# Altium schematic sheet ESP32_CAM.SchDoc
size B; ApprovedBy: Kosnstantine; Engineer: Ehsan Shaghaei; SheetNumber: 2; SheetTotal: 7
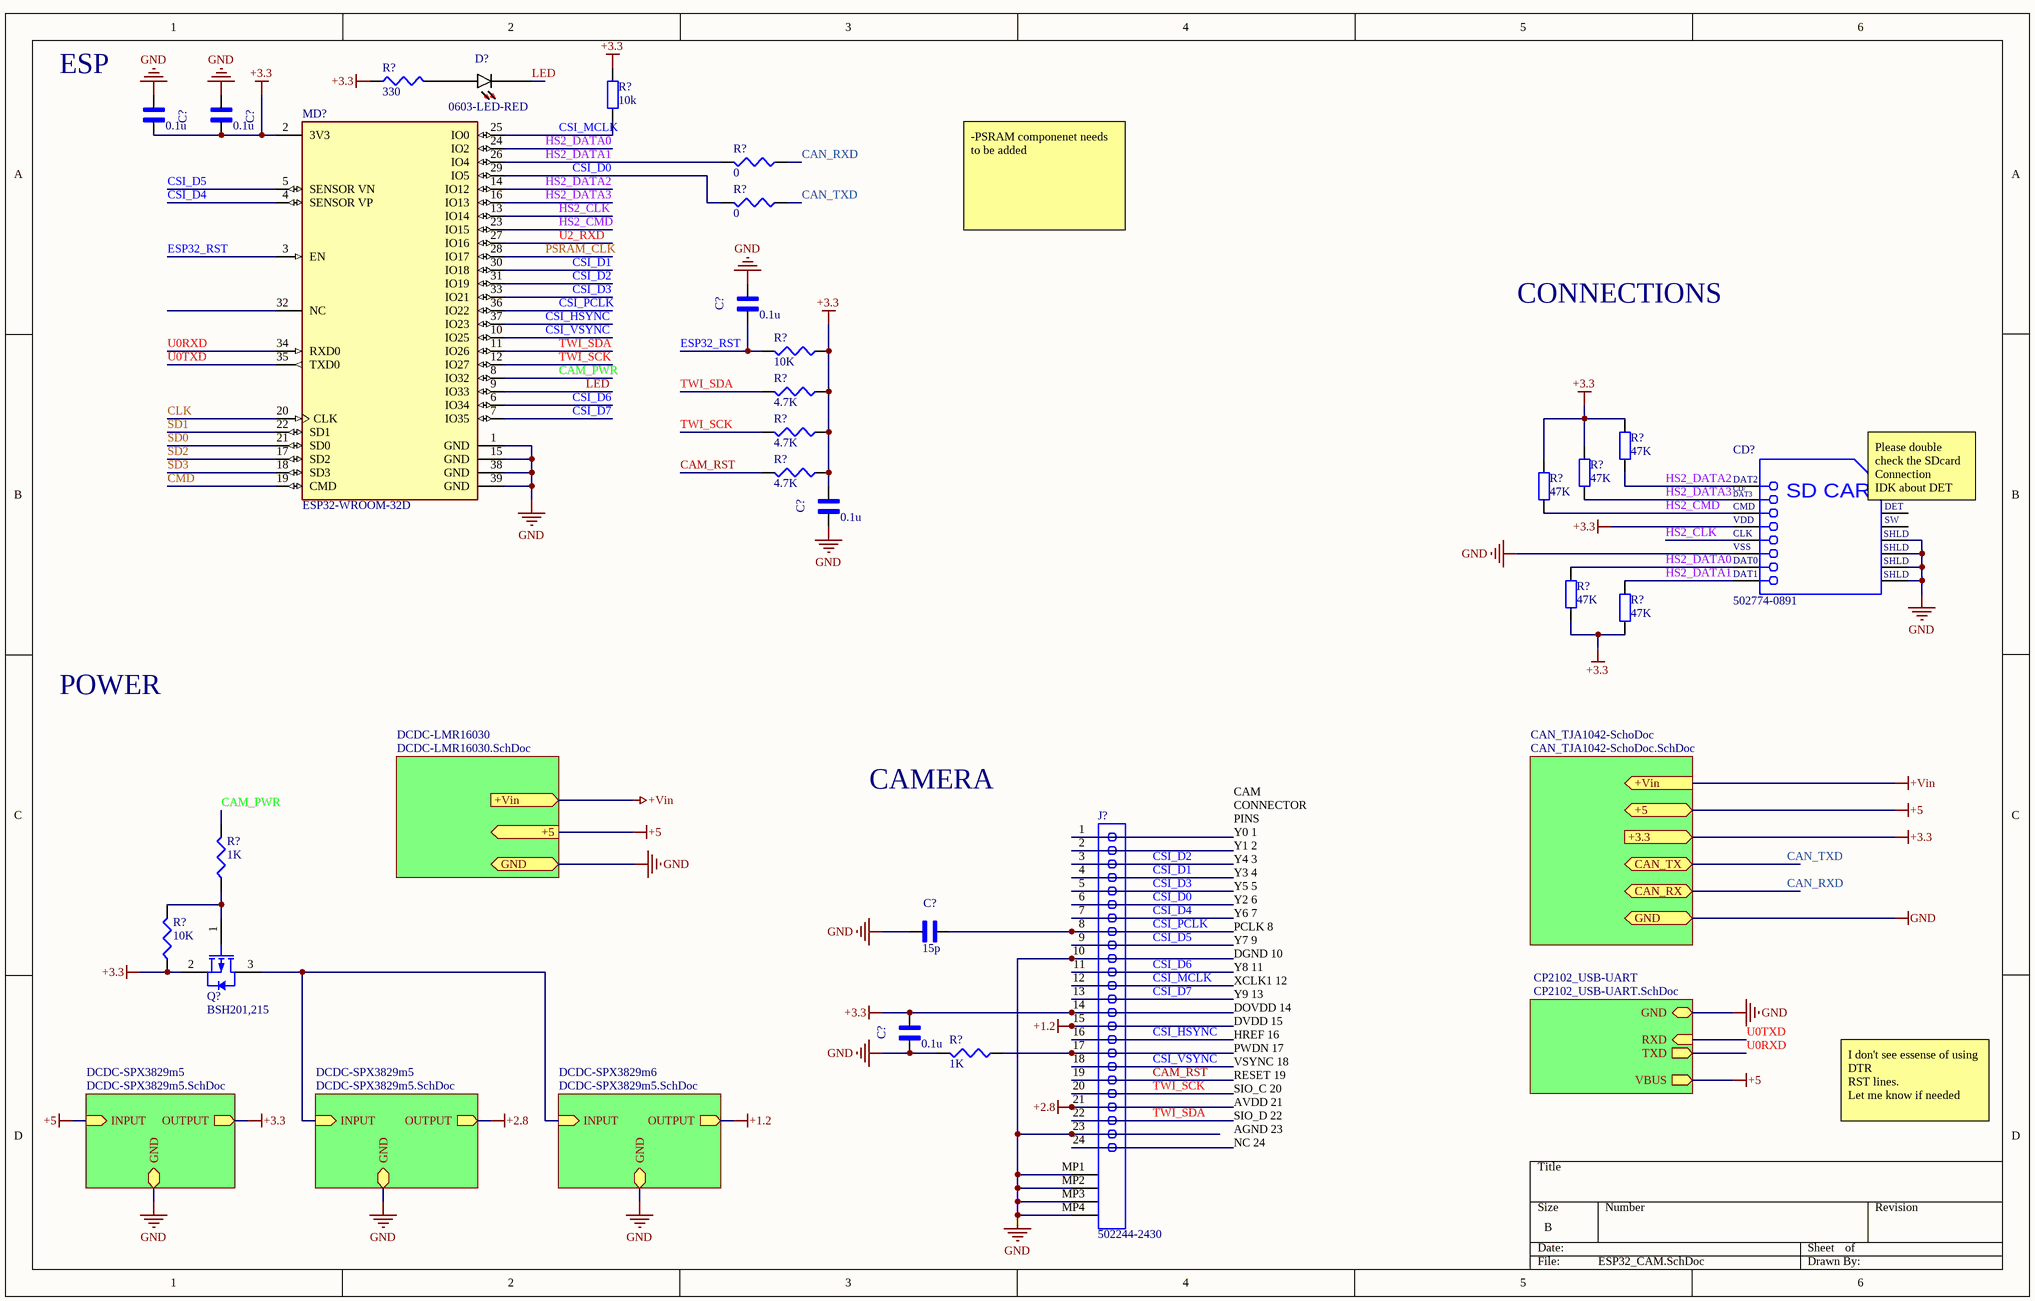
[diagram p0: ESP32_CAM.SchDoc]

## Parts
(Parts that share a designator on the sheet are numbered #1, #2 ... from top to bottom, then left to right.)
C?#1  value 0.1u  [*CAPC1608X90]  (hidden comment: GX035C104MAT2-500)
C?#2  value 0.1u  [*CAPC1608X90]  (hidden comment: GX035C104MAT2-500)
C?#3  value 0.1u  [*CAPC1608X90]  (hidden comment: GX035C104MAT2-500)
C?#4  value 0.1u  [*CAPC1608X90]  (hidden comment: GX035C104MAT2-500)
C?#5  value 15p  [*CAPC1608X90]  (hidden comment: GX035C104MAT2-500)
C?#6  value 0.1u  [*CAPC1608X90]  (hidden comment: GX035C104MAT2-500)
CD?  502774-0891  [MOLX-502774-0891_V]
D?  0603-LED-RED  [*LEDM1608X80_LTE-C1906R-14(Primary)]
J?  502244-2430  [MOLX-502244-2430]
MD?  ESP32-WROOM-32D  [FP-ESP32-WROOM-32D-MFG]
Q?  BSH201,215  [NXP-SOT23_M]
R?#1  value 330  [J1-0603]  (hidden comment: RC0603FR-07330RL)
R?#2  value 10k  [0603]  (hidden comment: Res2)
R?#3  value 0  [J1-0603]  (hidden comment: Res3)
R?#4  value 0  [J1-0603]  (hidden comment: Res3)
R?#5  value 10K  [J1-0603]  (hidden comment: Res3)
R?#6  value 4.7K  [J1-0603]  (hidden comment: Res3)
R?#7  value 4.7K  [J1-0603]  (hidden comment: Res3)
R?#8  value 47K  [0603]  (hidden comment: Res2)
R?#9  value 4.7K  [J1-0603]  (hidden comment: Res3)
R?#10  value 47K  [0603]  (hidden comment: Res2)
R?#11  value 47K  [0603]  (hidden comment: Res2)
R?#12  value 47K  [0603]  (hidden comment: Res2)
R?#13  value 47K  [0603]  (hidden comment: Res2)
R?#14  value 1K  [J1-0603]  (hidden comment: Res3)
R?#15  value 10K  [J1-0603]  (hidden comment: Res3)
R?#16  value 1K  [J1-0603]  (hidden comment: Res3)

## Sub-sheets
CAN_TJA1042-SchoDoc = CAN_TJA1042-SchoDoc.SchDoc: no entries
CP2102_USB-UART = CP2102_USB-UART.SchDoc: GND (bidir), VBUS (out), TXD (out), RXD (in)
DCDC-LMR16030 = DCDC-LMR16030.SchDoc: no entries
DCDC-SPX3829m5 = DCDC-SPX3829m5.SchDoc: GND (bidir), INPUT (in), OUTPUT (out)
DCDC-SPX3829m5 = DCDC-SPX3829m5.SchDoc: GND (bidir), INPUT (in), OUTPUT (out)
DCDC-SPX3829m6 = DCDC-SPX3829m5.SchDoc: GND (bidir), INPUT (in), OUTPUT (out)

## Ports
+3.3 (in), +5 (bidir), +5 (out), +Vin (in), +Vin (out), CAN_RX (bidir), CAN_TX (bidir), GND (bidir)

## Nets
+1.2: J?.15 ; sheet DCDC-SPX3829m6/OUTPUT
+2.8: J?.21 ; sheet DCDC-SPX3829m5/OUTPUT
+3.3: C?#1.1 C?#2.1 C?#4.1 C?#6.1 CD?.4(VDD) J?.14 MD?.2(3V3) Q?.2(S) R?#1.1 R?#2.2 R?#5.1 R?#6.1 R?#7.1 R?#8.2 R?#9.1 R?#10.2 R?#11.2 R?#12.2 R?#13.2 R?#15.1 ; port +3.3, sheet DCDC-SPX3829m5/OUTPUT
+5: port +5, sheet DCDC-SPX3829m5/INPUT, sheet CP2102_USB-UART/VBUS
+Vin: port +Vin
GND: C?#1.2 C?#2.2 C?#3.1 C?#4.2 C?#5.2 C?#6.2 CD?.6(VSS) CD?.11(SHLD) CD?.12(SHLD) CD?.13(SHLD) CD?.14(SHLD) J?.10 J?.23 J?.MP1 J?.MP2 J?.MP3 J?.MP4 MD?.1(GND) MD?.15(GND) MD?.38(GND) MD?.39(GND) R?#16.2 ; port GND, sheet DCDC-SPX3829m5/GND, sheet DCDC-SPX3829m5/GND, sheet DCDC-SPX3829m6/GND, sheet CP2102_USB-UART/GND
CAM_PWR: MD?.8(IO32) R?#14.2
CAM_RST: J?.19 R?#9.2
CAN_RXD: R?#3.1 ; port CAN_RX
CAN_TXD: R?#4.1 ; port CAN_TX
CLK: MD?.20(CLK)
CMD: MD?.19(CMD)
CSI_D0: J?.6 MD?.29(IO5) R?#4.2
CSI_D1: J?.4 MD?.30(IO18)
CSI_D2: J?.3 MD?.31(IO19)
CSI_D3: J?.5 MD?.33(IO21)
CSI_D4: J?.7 MD?.4(SENSOR_VP)
CSI_D5: J?.9 MD?.5(SENSOR_VN)
CSI_D6: J?.11 MD?.6(IO34)
CSI_D7: J?.13 MD?.7(IO35)
CSI_HSYNC: J?.16 MD?.37(IO23)
CSI_MCLK: J?.12 MD?.25(IO0) R?#2.1
CSI_PCLK: C?#5.1 J?.8 MD?.36(IO22)
CSI_VSYNC: J?.18 MD?.10(IO25)
ESP32_RST: C?#3.2 MD?.3(EN) R?#5.2
HS2_CLK: CD?.5(CLK) MD?.13(IO14)
HS2_CMD: CD?.3(CMD) MD?.23(IO15) R?#11.1
HS2_DATA0: CD?.7(DAT0) MD?.24(IO2) R?#12.1
HS2_DATA1: CD?.8(DAT1) MD?.26(IO4) R?#3.2 R?#13.1
HS2_DATA2: CD?.1(DAT2) MD?.14(IO12) R?#8.1
HS2_DATA3: CD?.2(CD/DAT3) MD?.16(IO13) R?#10.1
LED: D?.C MD?.9(IO33)
PSRAM_CLK: MD?.28(IO17)
SD0: MD?.21(SD0)
SD1: MD?.22(SD1)
SD2: MD?.17(SD2)
SD3: MD?.18(SD3)
TWI_SCK: J?.20 MD?.12(IO27) R?#7.2
TWI_SDA: J?.22 MD?.11(IO26) R?#6.2
U0RXD: MD?.34(RXD0) ; sheet CP2102_USB-UART/TXD
U0TXD: MD?.35(TXD0) ; sheet CP2102_USB-UART/RXD
U2_RXD: MD?.27(IO16)
NetD?_A: D?.A R?#1.2
NetJ?_17: J?.17 R?#16.1
NetQ?_1: Q?.1(G) R?#14.1 R?#15.2
NetQ?_3: Q?.3(D) ; sheet DCDC-SPX3829m5/INPUT, sheet DCDC-SPX3829m6/INPUT

Not connected (* = marked no-connect by the designer): CD? 9(DETECT) 10(SWITCH); J? 1 2 24; MD? 32(NC)

## Notes on the sheet
- ESP
- -PSRAM componenet needs to be added
- CONNECTIONS
- (near CD?) Please double check the SDcard Connection
  IDK about DET and SW
- POWER
- CAMERA
- I don't see essense of using
  DTR
  RST lines.
  Let me know if needed
- CAM CONNECTOR PINS
  Y0 1
  Y1 2
  Y4 3
  Y3 4
  Y5 5
  Y2 6
  Y6 7
  PCLK 8
  Y7 9
  DGND 10
  Y8 11
  XCLK1 12
  Y9 13
  DOVDD 14
  DVDD 15
  HREF 16
  PWDN 17
  VSYNC 18
  RESET 19
  SIO_C 20
  AVDD 21
  SIO_D 22
  AGND 23
  NC 24
- (in symbol CMP-2000-05248-1) CD/; DAT3; SD CARD; DET; SW

## Library data of the parts
C?#1-C?#6 = GX035C104MAT2-500: Cap Thin Film 0.1uf 50v 0603; MF: AVX; MP: GX035C104MAT2-500 or CL10B104JB8NNNC; Pacage Metric: 1608; Type: SMD; Package: 0603 AVX; SnapEDA_Link: https://www.snapeda.com/parts/GX035C104MAT2-500/AVX/view-part/?ref=snap
CD? = CMP-2000-05248-1: Micro SD Memory Card Connector, 0.5 A, 10 V (DC), -25 to 85 degC, 8-Pin SMT, RoHS, Tape and Reel; Manufacturer: Molex; 3D Model: 502774-0891.stp; Online Catalog: microSD™Series; Number of Positions: 10(8+2); Card Type: SecureDigital-microSD™; Insertion, Removal Method: PushIn,PushOut; Other Names: WM24066DKR; Connector Type: ConnectorandEjector; Value: 1n; Features: Switch; Family: MemoryConnectors-PCCardSockets; Manufacturer URL: http://www.molex.com/; Mounting Type: SurfaceMount,RightAngle; Contact Finish Thickness: 20µin(0.51µm); Standard Package: 1; Series: 502774; Ejector Side: -; Datasheet Version: Rev. D, 04/2004; Category: Connectors,Interconnects; Contact Finish: Gold; Datasheet URL: https://datasheet.ciiva.com/1104/1499551-1104671.pdf; RoHS Information: 502774-0891CertofCompliance; Mounting Feature: Reverse-Bottom; Packaging: Digi-Reel; Height Above Board: 0.071"(1.80mm); Catalog Drawings: 502774-0891
D? = 0603-LED-RED: Red 620nm LED Indication - Discrete 2.2V 0603 (1608 Metric); MP: LTST-C194KRKT or SML-D12U1WT86; Type: SMD; Package: 0603 Lite-On; SnapEDA_Link: https://www.snapeda.com/parts/LTE-C1906R-14/Lite-On%20Inc./view-part/?ref=snap; Value: *
J? = CMP-1243-00005-1: 0.5 mm Pitch Easy-On(TM) Type FFC Connector, for LVDS, 2.33 mm Mated Height, Right Angle, ZIF, SMT, Bottom Contact, 24 Circuits, -25 to 85 degC, ELV and RoHS Compliant, Tape and Reel; Manufacturer: Molex; Circuits (Loaded): 24; Material - Plating Mating: Gold; Entry Angle: 90degrees Angle; Pitch - Mating Interface: 0.50mm; PCB Locator: No; Material - Metal: Phosphor Bronze; PCB Retention: Yes; Current (Max per Contact): 0.4A; Mated Height: 2.33mm; Durability (mating cycles max): 20; Voltage (Max): 50V AC (RMS)/DC; Contact Position: Bottom; ComponentLink1Description: Manufacturer URL; Mounting Technology: Surface Mount; PackageDescription: 24-Lead FFC Connector, Pitch 0.5 mm; ComponentLink3URL: http://www.molex.com/pdm_docs/sd/5022442430_sd.pdf; ComponentLink2URL: http://www.molex.com/webdocs/datasheets/pdf/en-us/5022442430_FFC_FPC_CONNECTORS.pdf; Packing: Tape and Reel; ComponentLink3Description: Package Specification; PackageVersion: Rev. C, 03/2010; PartNumber: 502244-2430; Number of Rows: 1; PackageReference: 502244-2430; RoHS: TRUE; Stackable: No; ComponentLink2Description: Datasheet; ComponentLink1URL: http://www.molex.com/molex/index.jsp; Polarized to PCB: Yes; Material - Plating Termination: Gold; Orientation: Right Angle
MD? = CMP-194065-000003-1: WIFI MODULE 32MBITS SPI FLASH; Manufacturer: Espressif Systems; Max Supply Voltage: 3.6V; Nominal Supply Current: 500mA; Max Frequency: 2484MHz; Number Of Adc Channels: 16; Number Of Gpio: 32; Interface: I2C,SPI,UART,Ethernet,I2S,Other; Data Rate: 150Mbits/s; Min Supply Voltage: 3V; Bandwidth: 72MHz; Sensitivity: -98dBm; Octopart: https://octopart.com/esp32-wroom-32d-espressif+systems-91040050; Package: ESP32-WROOM-32D; ComponentLink2URL: https://www.espressif.com/sites/default/files/documentation/esp32-wroom-32d_esp32-wroom-32u_datasheet_en.pdf; Lead Free: Yes; Category: UNK; Mouser Description: Wi-Fi/BT BLE Module ESP32-D0WD, SPI Flash, UART, P; Device Class L1: Integrated Circuits (ICs); RoHS: TRUE; Temperature Range Low: -40°C; ComponentLink2Description: Datasheet; Digikey Description: WIFI MODULE 32MBITS SPI FLASH; Height: 3.2mm; Temperature: -40°C to +85°C; Manufacturer Part Number: ESP32-WROOM-32D; Device Class L3: Transceivers; Device Class L2: RF Semiconductors and Devices; Temperature Range High: +85°C; Automotive: No
Q? = CMP-1258-00153-1: P-Channel Enhancement Mode MOS Transistor, -60 V, -0.3 A, -55 to 150 degC, 3-Pin SOT23, Tape and Reel; Manufacturer: NXP Semiconductors; Ciss [typ] (pF): 70; Qr [typ] (nC): 58; VGSth [typ] (V): -1.9; Channel Type: P; Coss [typ] (pF): 15; Packing: Tape & Reel; PackageReference: SOT23; Code_JEDEC: TO-236AB; PartNumber: BSH201,215; ID [max] (A): -0.3; ComponentLink1URL: http://www.nxp.com/; PackageDescription: 3-Pin Small Outline Transistor Package, Body 2.9 x 1.3 mm, Pitch 0.95 mm; PackageVersion: 06-03-16, 03/2006; DatasheetVersion: Rev. 1.000; ComponentLink2URL: http://www.nxp.com/documents/data_sheet/BSH201.pdf; Mounting Technology: Surface Mount; ComponentLink1Description: Manufacturer URL; ComponentLink2Description: Datasheet; ComponentLink3Description: Package Specification; ComponentLink3URL: http://www.nxp.com/documents/outline_drawing/sot023_po.pdf; VDS [max] (V): -60
R?#1 = RC0603FR-07330RL: 330 Ohms ±1% 0.1W, 1/10W Chip Resistor 0603 (1608 Metric) Thick Film; Pacage Metric: 1608; MF: Yageo or NXP; ChipDip_Link: https://www.chipdip.ru/product0/9000079628; HelpURL: https://www.chipdip.ru/product0/9000079628; Package: R0603; Type: SMD; MP: RC0603FR-07330RL; SnapEDA_Link: https://www.snapeda.com/parts/RC0603FR-07330RL/Yageo/view-part/?ref=search&t=RC0603FR-07330RL
R?#2 R?#8 R?#10-R?#13 = Res2: Resistor; Published: 8-Jun-2000; LatestRevisionDate: 17-Jul-2002; LatestRevisionNote: Re-released for DXP Platform.; PackageReference: AXIAL-0.4; Publisher: Altium Limited
R?#3-R?#7 R?#9 R?#14-R?#16 = Res3: Resistor; Pacage Metric: 1608; MP: RC0603FR-0756KL; ChipDip_Link: https://www.chipdip.ru/product0/9000079754; HelpURL: https://www.chipdip.ru/product0/9000079754; Package: R0603; Type: SMD